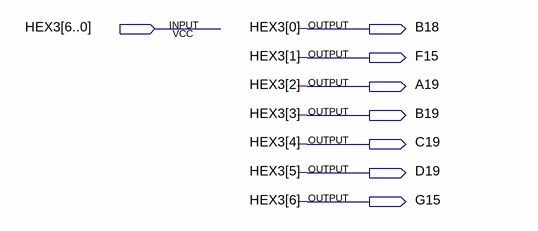
[diagram p0: schematic sheet]
// Quartus schematic Display3.bdf as structural Verilog: 0 symbols, 8 pins
module Display3 (
  input  [6:0] HEX3,
  output B18,
  output F15,
  output A19,
  output B19,
  output C19,
  output D19,
  output G15
);


  assign A19 = HEX3[2];
  assign B18 = HEX3[0];
  assign B19 = HEX3[3];
  assign C19 = HEX3[4];
  assign D19 = HEX3[5];
  assign F15 = HEX3[1];
  assign G15 = HEX3[6];
endmodule
